# Altium project Differential_Relay.PrjPcb
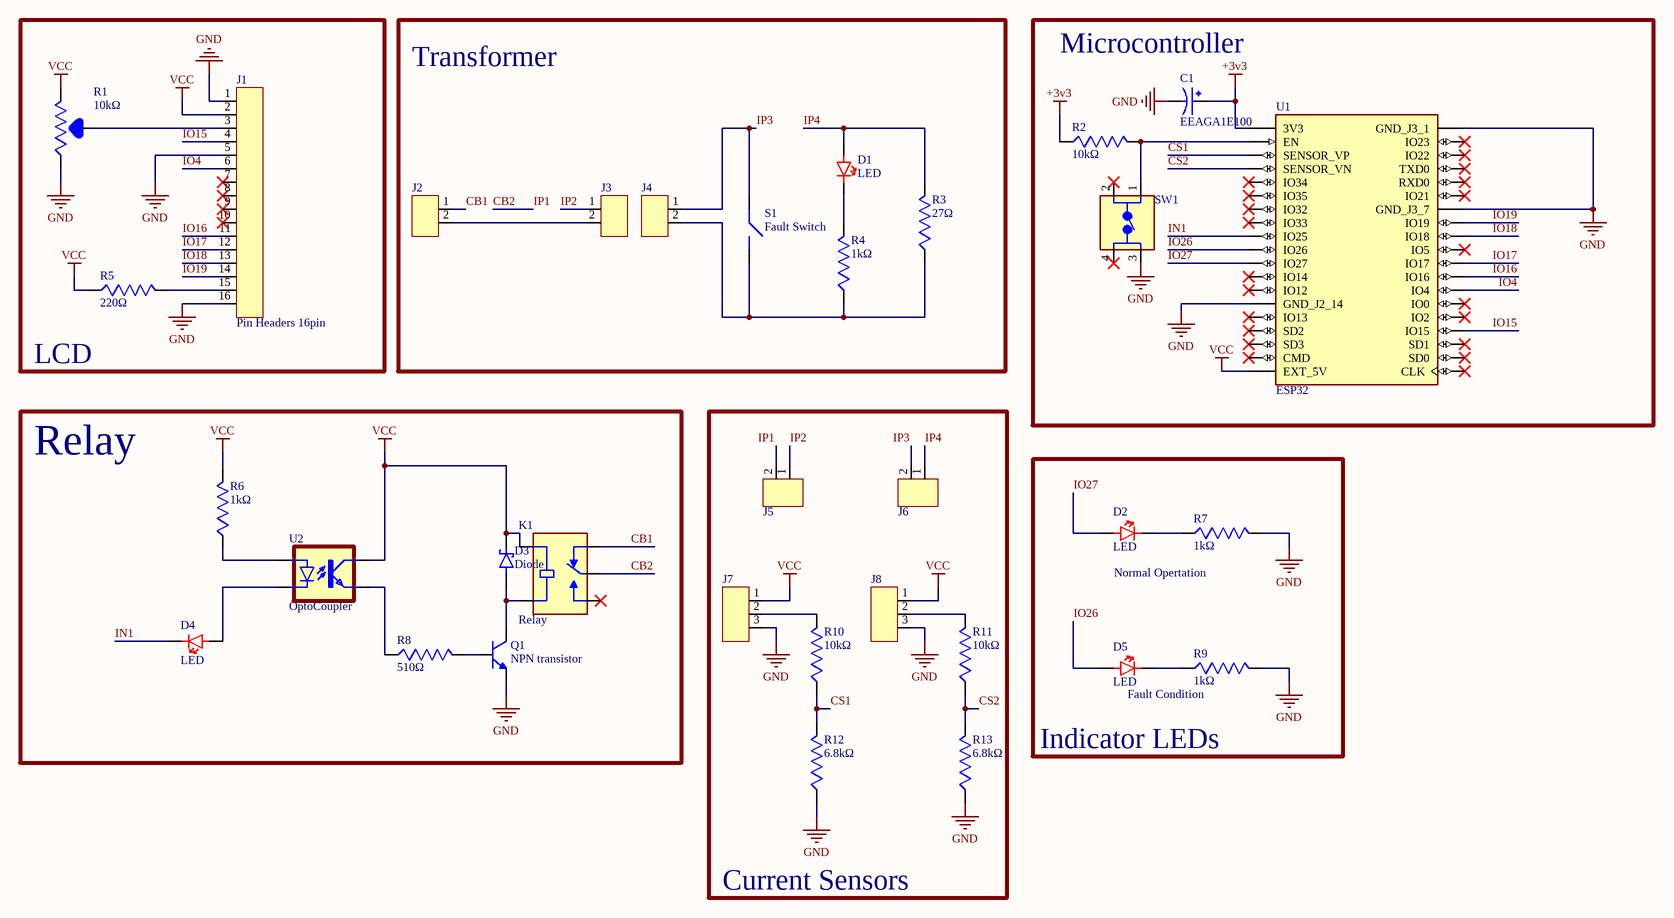
[diagram p0: Sheet1.SchDoc]
1 sheet, 33 parts. Net scope: global (net labels, ports and power ports of the same name join across sheets).
Board file: PCB1.PcbDoc

## Sheet Sheet1.SchDoc
size B; SheetNumber: 1; SheetTotal: 1

### Parts
C1  EEAGA1E100  [CAPPRD150W45D400H700]
D1  LED  [LED]
D2  LED  [LED]
D3  Diode  [Diode]
D4  LED  [LED]
D5  LED  [LED]
J1  Pin Headers 16pin  [16 pin header]
J2  (no value)  [Barrier terminal]
J3  (no value)  [Barrier terminal]
J4  (no value)  [Barrier terminal]
J5  (no value)  [2 Pin header]
J6  (no value)  [2 Pin header]
J7  (no value)  [CURRENT SENSOR]
J8  (no value)  [CURRENT SENSOR]
K1  Relay  [Relay]
Q1  NPN transistor  [2N2222]
R1  10kΩ  [Pot_resistor]
R2  10kΩ  [resistor]
R3  27Ω  [Power res]
R4  1kΩ  [resistor]
R5  220Ω  [resistor]
R6  1kΩ  [resistor]
R7  1kΩ  [resistor]
R8  510Ω  [resistor]
R9  1kΩ  [resistor]
R10  10kΩ  [resistor]
R11  10kΩ  [resistor]
R12  6.8kΩ  [resistor]
R13  6.8kΩ  [resistor]
S1  Fault Switch  [Fault switch]
SW1  Tact_Switch  [Tact_Switch]  (value not drawn)
U1  ESP32  [ESP32]
U2  OptoCoupler  [opto]

### Blocks framed on the sheet
LCD: J1 R1 R5
Transformer: D1 J2-J4 R3 R4 S1
Microcontroller: C1 R2 SW1 U1
Relay: D3 D4 K1 Q1 R6 R8 U2
Current Sensors: J5-J8 R10-R13
Indicator LEDs: D2 D5 R7 R9

### Nets
+3v3: C1.P R2.1 U1.J2_1(3V3)
GND: C1.N J1.1 J1.5 J1.16 J7.3 J8.3 Q1.1(E) R1.1 R7.2 R9.2 R12.1 R13.1 SW1.3 U1.J2_14(GND_J2_14) U1.J3_1(GND_J3_1) U1.J3_7(GND_J3_7)
VCC: D3.1(K) J1.2 J7.1 J8.1 K1.COIL1 R1.2 R5.1 R6.2 U1.J2_19(EXT_5V) U2.4(COL)
CB1: J2.1 K1.NC
CB2: J5.2 K1.COM  [also labelled IP1]
CS1: R10.1 R12.2 U1.J2_3(SENSOR_VP)
CS2: R11.1 R13.2 U1.J2_4(SENSOR_VN)
IN1: D4.2(K) U1.J2_9(IO25)
IO4: J1.6 U1.J3_13(IO4)
IO15: J1.4 U1.J3_16(IO15)
IO16: J1.11 U1.J3_12(IO16)
IO17: J1.12 U1.J3_11(IO17)
IO18: J1.13 U1.J3_9(IO18)
IO19: J1.14 U1.J3_8(IO19)
IO26: D5.1(A) U1.J2_10(IO26)
IO27: D2.1(A) U1.J2_11(IO27)
IP2: J3.1 J5.1
IP3: J4.1 J6.2 S1.1
IP4: D1.1(A) J6.1 R3.2
NetD1_2: D1.2(K) R4.2
NetD2_2: D2.2(K) R7.1
NetD3_2: D3.2(A) K1.COIL2 Q1.3(C)
NetD4_1: D4.1(A) U2.2(C)
NetD5_2: D5.2(K) R9.1
NetJ1_3: J1.3 R1.3
NetJ1_15: J1.15 R5.2
NetJ2_2: J2.2 J3.2
NetJ4_2: J4.2 R3.1 R4.1 S1.2
NetJ7_2: J7.2 R10.2
NetJ8_2: J8.2 R11.2
NetQ1_2: Q1.2(B) R8.2
NetR2_2: R2.2 SW1.1 U1.J2_2(EN)
NetR6_1: R6.1 U2.1(A)
NetR8_1: R8.1 U2.3(EMIT)

Not connected (* = marked no-connect by the designer): J1 7* 8* 9* 10*; K1 NO*; SW1 2* 4*; U1 J2_5(IO34)* J2_6(IO35)* J2_7(IO32)* J2_8(IO33)* J2_12(IO14)* J2_13(IO12)* J2_15(IO13)* J2_16(SD2)* J2_17(SD3)* J2_18(CMD)* J3_2(IO23)* J3_3(IO22)* J3_4(TXD0)* J3_5(RXD0)* J3_6(IO21)* J3_10(IO5)* J3_14(IO0)* J3_15(IO2)* J3_17(SD1)* J3_18(SD0)* J3_19(CLK)*

### Notes on the sheet
- Normal Opertation
- Fault Condition

### Library data of the parts
C1 = EEAGA1E100: CAP ALUM 10UF 20% 25V RADIAL; MF: Panasonic; MP: EEA-GA1E100; Package: RADIAL-2 Panasonic; Price: None; Check_prices: https://www.snapeda.com/parts/EEA-GA1E100/Panasonic/view-part/2301584/?ref=eda; Value: *; SnapEDA_Link: https://www.snapeda.com/parts/EEA-GA1E100/Panasonic/view-part/2301584/?ref=snap; Availability: In Stock
J2-J4 = Terminal Barrier
J5 J6 = Pin Headers 2pins right angled
J7 J8 = Pin Headers 3pins
R1 = potentiometer
R2 R4-R13 = Resistor
R3 = Power Resistor